# Altium schematic sheet Teensy.SchDoc
size A4; SheetNumber: 3; SheetTotal: 3
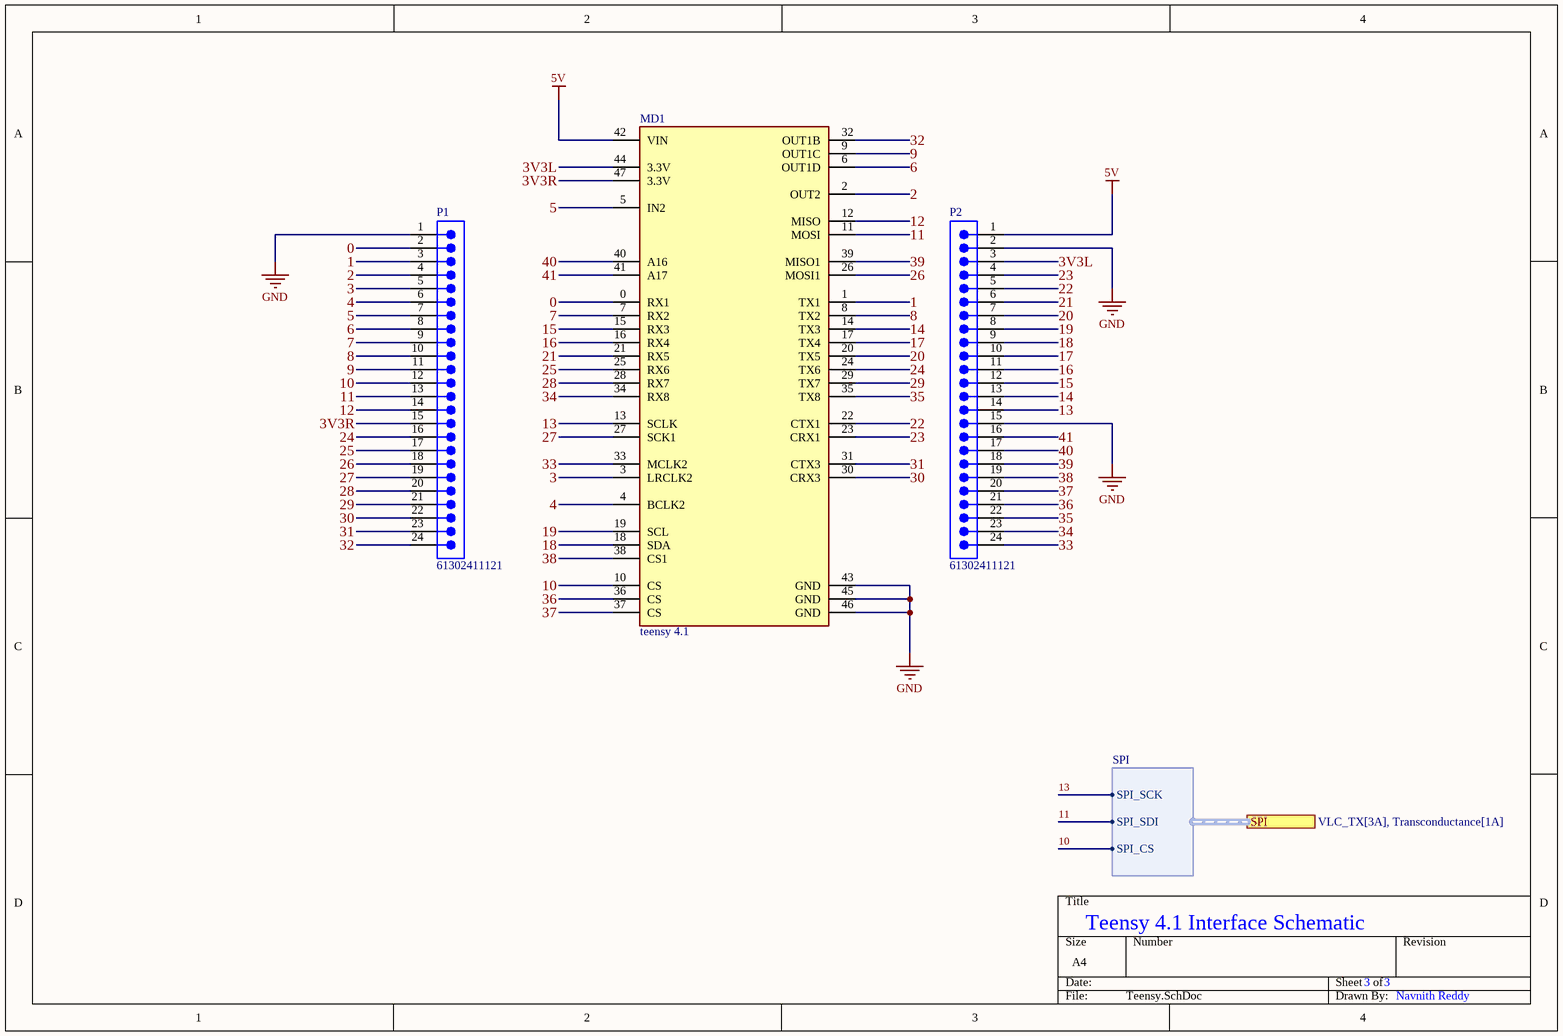
[diagram p0: Teensy.SchDoc]

## Parts
MD1  teensy 4.1  [FP-DEV-16996-MFG]
P1  61302411121  [61302411121]
P2  61302411121  [61302411121]

## Ports
SPI (harness SPI, see VLC_TX[3A], Transconductance[1A])

## Harnesses
SPI: SPI_SCK, SPI_SDI, SPI_CS

## Nets
5V: MD1.42(VIN) P2.1
GND: MD1.43(GND) MD1.45(GND) MD1.46(GND) P1.1 P2.2 P2.15
0: MD1.0(RX1) P1.2
1: MD1.1(TX1) P1.3
2: MD1.2(OUT2) P1.4
3: MD1.3(LRCLK2) P1.5
3V3L: MD1.44(3.3V) P2.3
3V3R: MD1.47(3.3V) P1.15
4: MD1.4(BCLK2) P1.6
5: MD1.5(IN2) P1.7
6: MD1.6(OUT1D) P1.8
7: MD1.7(RX2) P1.9
8: MD1.8(TX2) P1.10
9: MD1.9(OUT1C) P1.11
10: MD1.10(CS) P1.12 ; port SPI.SPI_CS
11: MD1.11(MOSI) P1.13 ; port SPI.SPI_SDI
12: MD1.12(MISO) P1.14
13: MD1.13(SCLK) P2.14 ; port SPI.SPI_SCK
14: MD1.14(TX3) P2.13
15: MD1.15(RX3) P2.12
16: MD1.16(RX4) P2.11
17: MD1.17(TX4) P2.10
18: MD1.18(SDA) P2.9
19: MD1.19(SCL) P2.8
20: MD1.20(TX5) P2.7
21: MD1.21(RX5) P2.6
22: MD1.22(CTX1) P2.5
23: MD1.23(CRX1) P2.4
24: MD1.24(TX6) P1.16
25: MD1.25(RX6) P1.17
26: MD1.26(MOSI1) P1.18
27: MD1.27(SCK1) P1.19
28: MD1.28(RX7) P1.20
29: MD1.29(TX7) P1.21
30: MD1.30(CRX3) P1.22
31: MD1.31(CTX3) P1.23
32: MD1.32(OUT1B) P1.24
33: MD1.33(MCLK2) P2.24
34: MD1.34(RX8) P2.23
35: MD1.35(TX8) P2.22
36: MD1.36(CS) P2.21
37: MD1.37(CS) P2.20
38: MD1.38(CS1) P2.19
39: MD1.39(MISO1) P2.18
40: MD1.40(A16) P2.17
41: MD1.41(A17) P2.16

## Notes on the sheet
- Teensy 4.1 Interface Schematic
- 3
- Navnith Reddy

## Library data of the parts
MD1 = CMP-157412-000001-1: TEENSY 4.1 (HEADERS)
P1 P2 = CMP-1502-01109-2: NexarPartId: 32855561; Number of Contacts: 24; Connector Type: Male Pin; Operating Supply Voltage: 250V; Pitch: 2.54mm; Gender: Male; Current Rating: 3A; Contact Resistance: 20mΩ; Mount: Through Hole; Contact Plating: Gold; Lead Pitch: 2.54mm; Orientation: Vertical; Color: Black; Packaging: Bulk; REACH SVHC: Unknown; Termination: Solder; Number of Positions: 24; RoHS: Compliant; Contact Mating Length: 5.9944mm; Number of Pins: 24; Contact Material: Copper; Number of Rows: 1